# EAGLE schematic INA169_Breakout (EAGLE 6.5.0)

## Sheet 1 of 14: PV
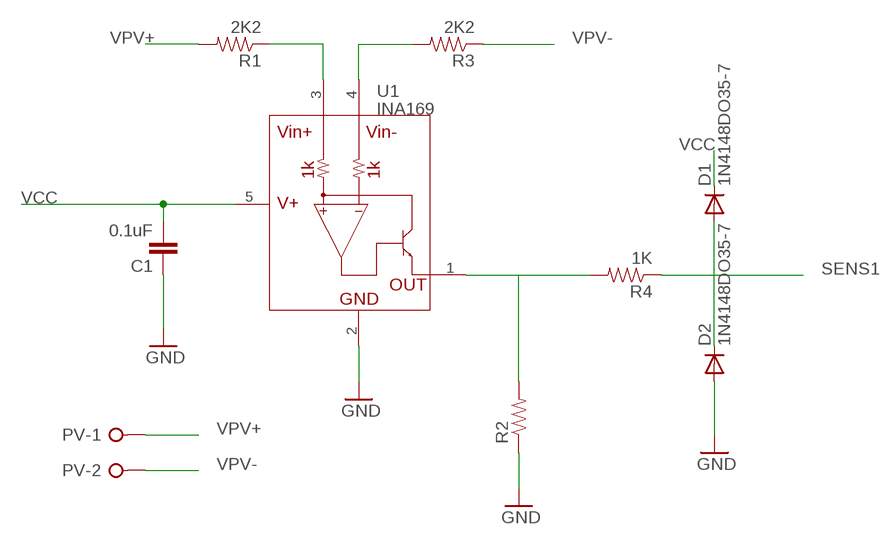
[diagram p0: schematic, sheet 1]

### Parts
C1  0.1uF  CAP0603-CAP  [0603-CAP]
D1  1N4148DO35-7  [DO35-7]
D2  1N4148DO35-7  [DO35-7]
PV  W237-02P  [W237-132]
R1  2K2  RESISTOR0603  [0603-RES]
R2  RESISTOR0603  [0603-RES]
R3  2K2  RESISTOR0603  [0603-RES]
R4  1K  RESISTOR0603  [0603-RES]
U1  INA169  [SOT23-5]

### Nets
GND: C1.1 D2.A R2.1 U1.2(GND) ; also sheet 2,3,4,5,6,7,8,9,10,11,12,13,14
N$1: R3.2 U1.4(VIN-)
N$2: R1.1 U1.3(VIN+)
N$3: R2.2 R4.2 U1.1(OUT)
SENS1: D1.A D2.C R4.1 ; also sheet 14
VCC: C1.2 D1.C U1.5(V+) ; also sheet 2,3,4,5,6,7,8,9,10,11,12,13,14
VPV+: PV.1 R1.2
VPV-: PV.2 R3.1

## Sheet 2 of 14: CHARGER
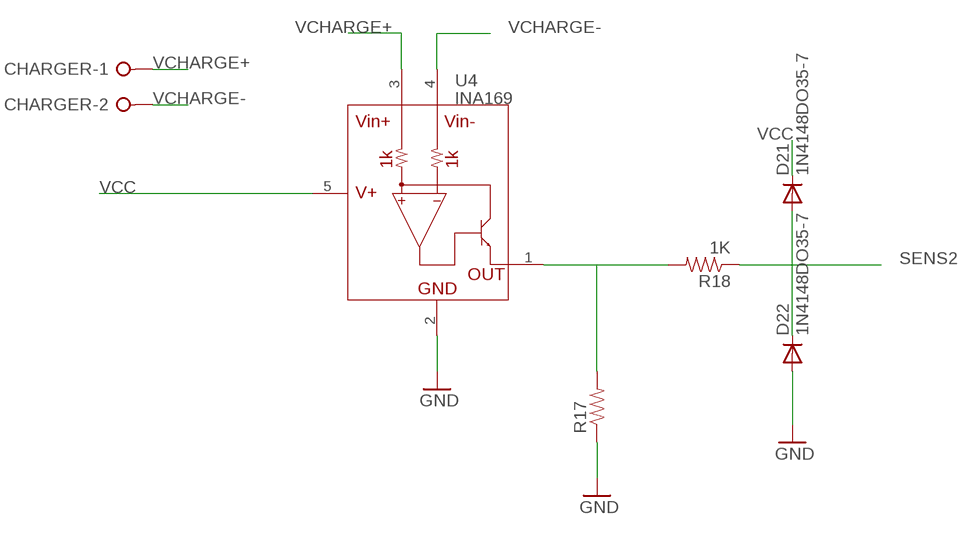
[diagram p1: schematic, sheet 2]

### Parts
CHARGER  W237-02P  [W237-132]
D21  1N4148DO35-7  [DO35-7]
D22  1N4148DO35-7  [DO35-7]
R17  RESISTOR0603  [0603-RES]
R18  1K  RESISTOR0603  [0603-RES]
U4  INA169  [SOT23-5]

### Nets
GND: D22.A R17.1 U4.2(GND) ; also sheet 1,3,4,5,6,7,8,9,10,11,12,13,14
N$4: R17.2 R18.2 U4.1(OUT)
SENS2: D21.A D22.C R18.1 ; also sheet 14
VCC: D21.C U4.5(V+) ; also sheet 1,3,4,5,6,7,8,9,10,11,12,13,14
VCHARGE+: CHARGER.1 U4.3(VIN+)
VCHARGE-: CHARGER.2 U4.4(VIN-)

## Sheet 3 of 14: BATT+
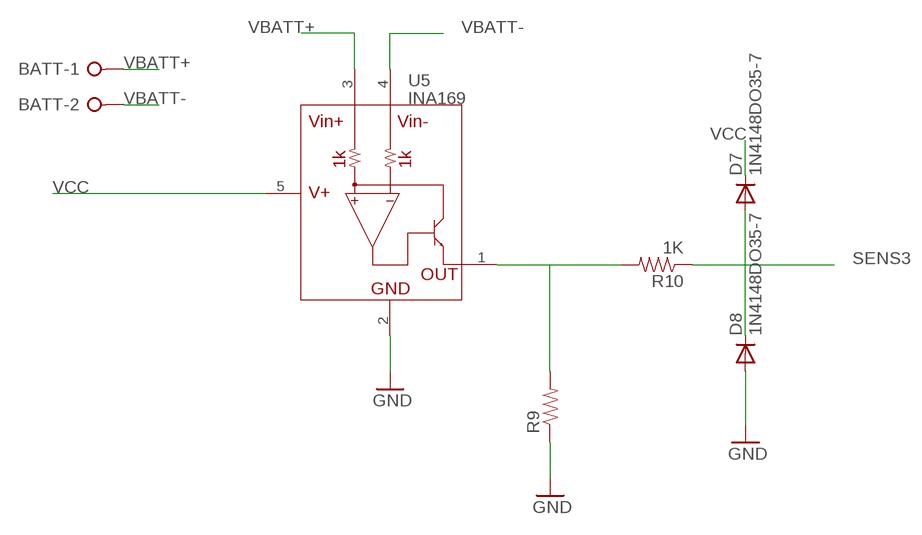
[diagram p2: schematic, sheet 3]

### Parts
BATT  W237-02P  [W237-132]
D7  1N4148DO35-7  [DO35-7]
D8  1N4148DO35-7  [DO35-7]
R9  RESISTOR0603  [0603-RES]
R10  1K  RESISTOR0603  [0603-RES]
U5  INA169  [SOT23-5]

### Nets
GND: D8.A R9.1 U5.2(GND) ; also sheet 1,2,4,5,6,7,8,9,10,11,12,13,14
N$5: R9.2 R10.2 U5.1(OUT)
SENS3: D7.A D8.C R10.1 ; also sheet 14
VBATT+: BATT.1 U5.3(VIN+) ; also sheet 4
VBATT-: BATT.2 U5.4(VIN-) ; also sheet 4
VCC: D7.C U5.5(V+) ; also sheet 1,2,4,5,6,7,8,9,10,11,12,13,14

## Sheet 4 of 14: BATT-
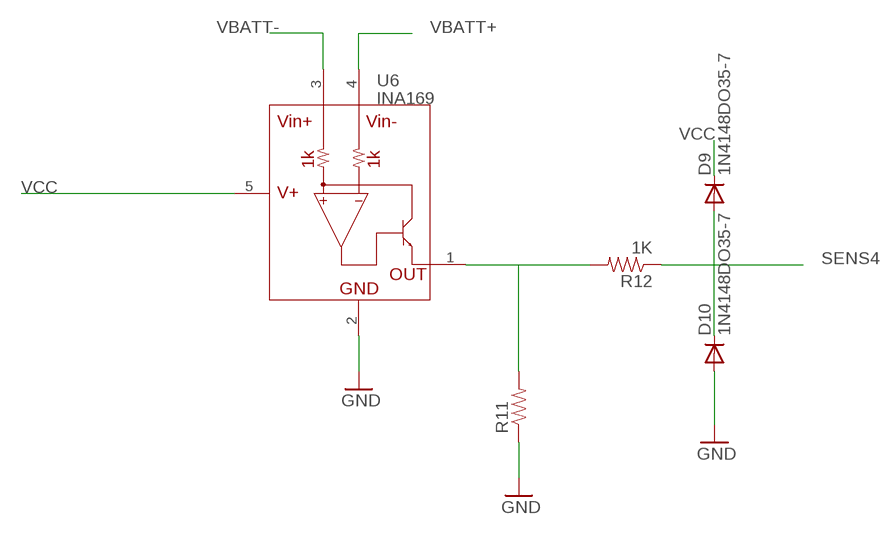
[diagram p3: schematic, sheet 4]

### Parts
D9  1N4148DO35-7  [DO35-7]
D10  1N4148DO35-7  [DO35-7]
R11  RESISTOR0603  [0603-RES]
R12  1K  RESISTOR0603  [0603-RES]
U6  INA169  [SOT23-5]

### Nets
GND: D10.A R11.1 U6.2(GND) ; also sheet 1,2,3,5,6,7,8,9,10,11,12,13,14
N$7: R11.2 R12.2 U6.1(OUT)
SENS4: D9.A D10.C R12.1 ; also sheet 14
VBATT+: U6.4(VIN-) ; also sheet 3
VBATT-: U6.3(VIN+) ; also sheet 3
VCC: D9.C U6.5(V+) ; also sheet 1,2,3,5,6,7,8,9,10,11,12,13,14

## Sheet 5 of 14: LOAD
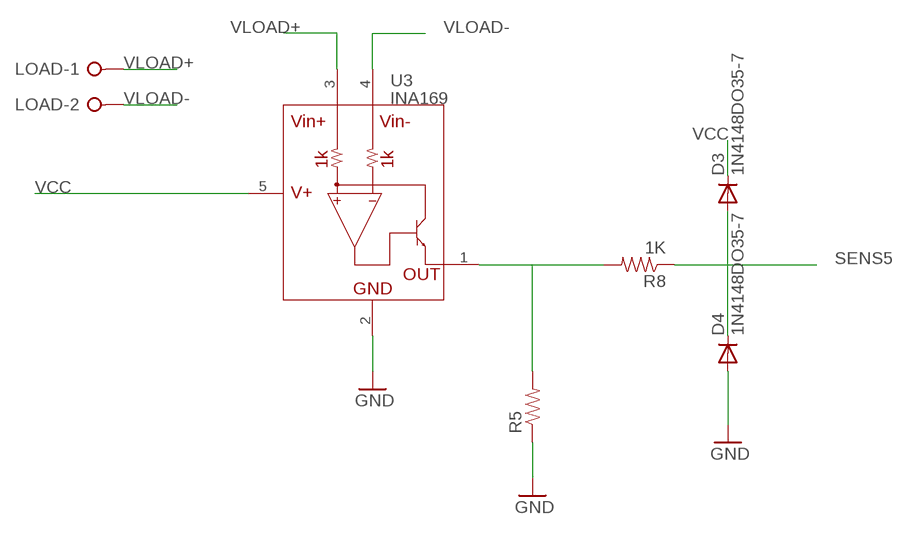
[diagram p4: schematic, sheet 5]

### Parts
D3  1N4148DO35-7  [DO35-7]
D4  1N4148DO35-7  [DO35-7]
LOAD  W237-02P  [W237-132]
R5  RESISTOR0603  [0603-RES]
R8  1K  RESISTOR0603  [0603-RES]
U3  INA169  [SOT23-5]

### Nets
GND: D4.A R5.1 U3.2(GND) ; also sheet 1,2,3,4,6,7,8,9,10,11,12,13,14
N$6: R5.2 R8.2 U3.1(OUT)
SENS5: D3.A D4.C R8.1 ; also sheet 14
VCC: D3.C U3.5(V+) ; also sheet 1,2,3,4,6,7,8,9,10,11,12,13,14
VLOAD+: LOAD.1 U3.3(VIN+)
VLOAD-: LOAD.2 U3.4(VIN-)

## Sheet 6 of 14: ADC1
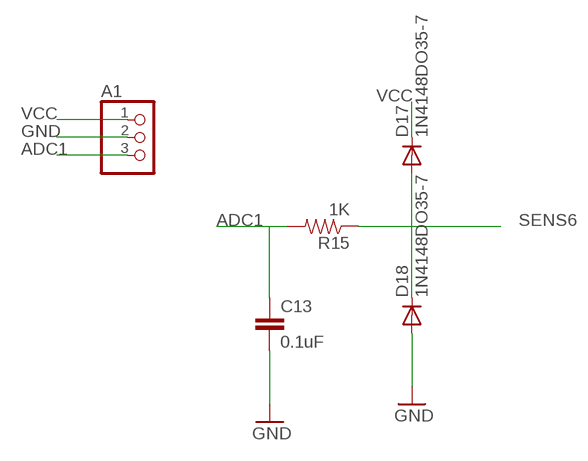
[diagram p5: schematic, sheet 6]

### Parts
A1  PINHD-1X3  [1X03]
C13  0.1uF  CAP0603-CAP  [0603-CAP]
D17  1N4148DO35-7  [DO35-7]
D18  1N4148DO35-7  [DO35-7]
R15  1K  RESISTOR0603  [0603-RES]

### Nets
ADC1: A1.3 C13.1 R15.2
GND: A1.2 C13.2 D18.A ; also sheet 1,2,3,4,5,7,8,9,10,11,12,13,14
SENS6: D17.A D18.C R15.1 ; also sheet 14
VCC: A1.1 D17.C ; also sheet 1,2,3,4,5,7,8,9,10,11,12,13,14

## Sheet 7 of 14: ADC2
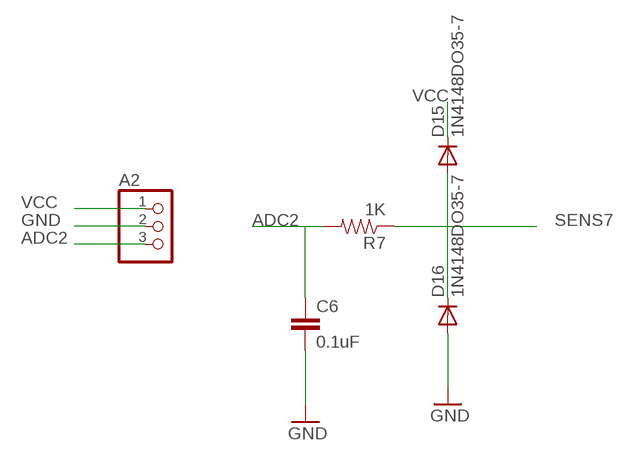
[diagram p6: schematic, sheet 7]

### Parts
A2  PINHD-1X3  [1X03]
C6  0.1uF  CAP0603-CAP  [0603-CAP]
D15  1N4148DO35-7  [DO35-7]
D16  1N4148DO35-7  [DO35-7]
R7  1K  RESISTOR0603  [0603-RES]

### Nets
ADC2: A2.3 C6.1 R7.2
GND: A2.2 C6.2 D16.A ; also sheet 1,2,3,4,5,6,8,9,10,11,12,13,14
SENS7: D15.A D16.C R7.1 ; also sheet 14
VCC: A2.1 D15.C ; also sheet 1,2,3,4,5,6,8,9,10,11,12,13,14

## Sheet 8 of 14: ADC3
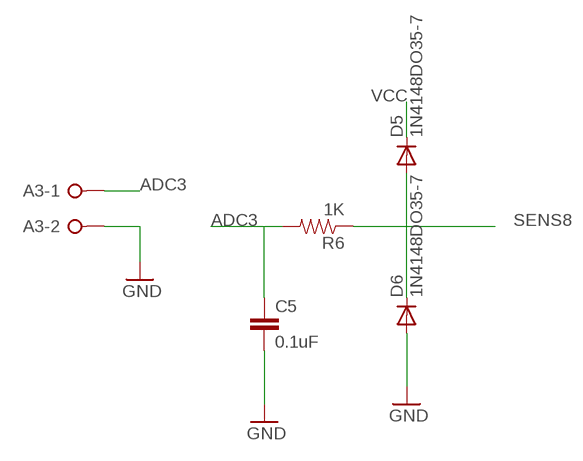
[diagram p7: schematic, sheet 8]

### Parts
A3  W237-02P  [W237-132]
C5  0.1uF  CAP0603-CAP  [0603-CAP]
D5  1N4148DO35-7  [DO35-7]
D6  1N4148DO35-7  [DO35-7]
R6  1K  RESISTOR0603  [0603-RES]

### Nets
ADC3: A3.1 C5.1 R6.2
GND: A3.2 C5.2 D6.A ; also sheet 1,2,3,4,5,6,7,9,10,11,12,13,14
SENS8: D5.A D6.C R6.1 ; also sheet 14
VCC: D5.C ; also sheet 1,2,3,4,5,6,7,9,10,11,12,13,14

## Sheet 9 of 14: ADC4
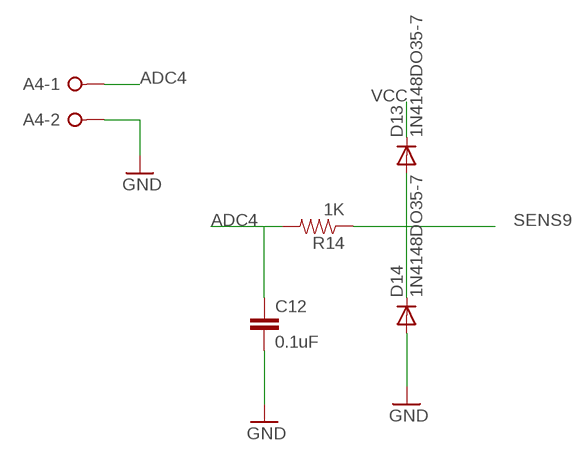
[diagram p8: schematic, sheet 9]

### Parts
A4  W237-02P  [W237-132]
C12  0.1uF  CAP0603-CAP  [0603-CAP]
D13  1N4148DO35-7  [DO35-7]
D14  1N4148DO35-7  [DO35-7]
R14  1K  RESISTOR0603  [0603-RES]

### Nets
ADC4: A4.1 C12.1 R14.2
GND: A4.2 C12.2 D14.A ; also sheet 1,2,3,4,5,6,7,8,10,11,12,13,14
SENS9: D13.A D14.C R14.1 ; also sheet 14
VCC: D13.C ; also sheet 1,2,3,4,5,6,7,8,10,11,12,13,14

## Sheet 10 of 14: ADC5
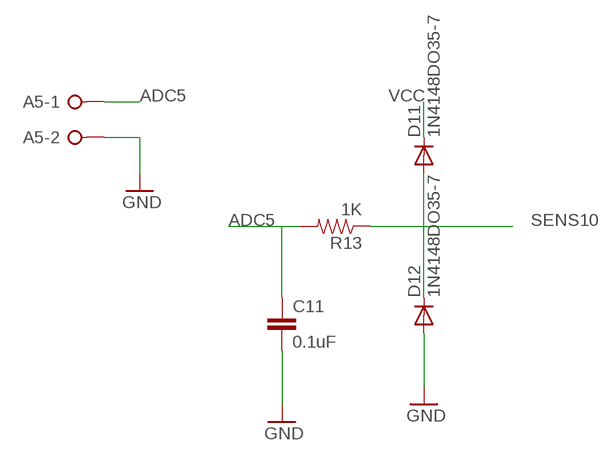
[diagram p9: schematic, sheet 10]

### Parts
A5  W237-02P  [W237-132]
C11  0.1uF  CAP0603-CAP  [0603-CAP]
D11  1N4148DO35-7  [DO35-7]
D12  1N4148DO35-7  [DO35-7]
R13  1K  RESISTOR0603  [0603-RES]

### Nets
ADC5: A5.1 C11.1 R13.2
GND: A5.2 C11.2 D12.A ; also sheet 1,2,3,4,5,6,7,8,9,11,12,13,14
SENS10: D11.A D12.C R13.1 ; also sheet 14
VCC: D11.C ; also sheet 1,2,3,4,5,6,7,8,9,11,12,13,14

## Sheet 11 of 14: RTC
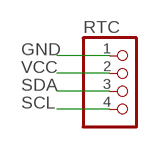
[diagram p10: schematic, sheet 11]

### Parts
RTC  PINHD-1X4/90  [1X04/90]

### Nets
GND: RTC.1 ; also sheet 1,2,3,4,5,6,7,8,9,10,12,13,14
SCL: RTC.4 ; also sheet 14
SDA: RTC.3 ; also sheet 14
VCC: RTC.2 ; also sheet 1,2,3,4,5,6,7,8,9,10,12,13,14

## Sheet 12 of 14: DHT
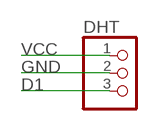
[diagram p11: schematic, sheet 12]

### Parts
DHT  PINHD-1X3  [1X03]

### Nets
D1: DHT.3 ; also sheet 14
GND: DHT.2 ; also sheet 1,2,3,4,5,6,7,8,9,10,11,13,14
VCC: DHT.1 ; also sheet 1,2,3,4,5,6,7,8,9,10,11,13,14

## Sheet 13 of 14: TSL
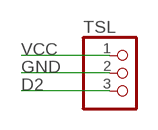
[diagram p12: schematic, sheet 13]

### Parts
TSL  PINHD-1X3  [1X03]

### Nets
D2: TSL.3 ; also sheet 14
GND: TSL.2 ; also sheet 1,2,3,4,5,6,7,8,9,10,11,12,14
VCC: TSL.1 ; also sheet 1,2,3,4,5,6,7,8,9,10,11,12,14

## Sheet 14 of 14: Shield
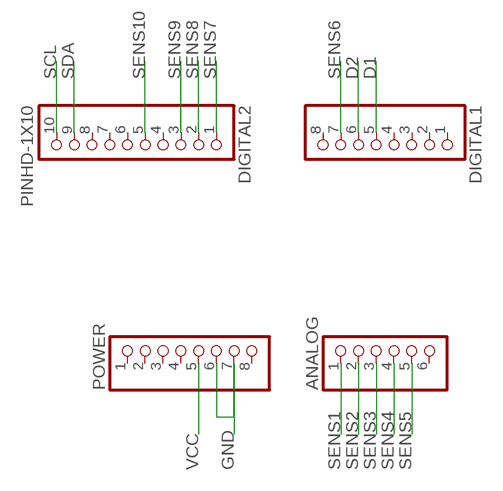
[diagram p13: schematic, sheet 14]

### Parts
ANALOG  PINHD-1X6B  [1X06-BIG]
DIGITAL1  PINHD-1X8BIG  [1X08-BIG]
DIGITAL2  PINHD-1X10  [1X10-BIG]
POWER  PINHD-1X8BIG  [1X08-BIG]

### Nets
D1: DIGITAL1.5 ; also sheet 12
D2: DIGITAL1.6 ; also sheet 13
GND: POWER.6 POWER.7 ; also sheet 1,2,3,4,5,6,7,8,9,10,11,12,13
SCL: DIGITAL2.10 ; also sheet 11
SDA: DIGITAL2.9 ; also sheet 11
SENS1: ANALOG.1 ; also sheet 1
SENS2: ANALOG.2 ; also sheet 2
SENS3: ANALOG.3 ; also sheet 3
SENS4: ANALOG.4 ; also sheet 4
SENS5: ANALOG.5 ; also sheet 5
SENS6: DIGITAL1.7 ; also sheet 6
SENS7: DIGITAL2.1 ; also sheet 7
SENS8: DIGITAL2.2 ; also sheet 8
SENS9: DIGITAL2.3 ; also sheet 9
SENS10: DIGITAL2.5 ; also sheet 10
VCC: POWER.5 ; also sheet 1,2,3,4,5,6,7,8,9,10,11,12,13
Unconnected: ANALOG.6 DIGITAL1.1 DIGITAL1.2 DIGITAL1.3 DIGITAL1.4 DIGITAL1.8 DIGITAL2.4 DIGITAL2.6 DIGITAL2.7 DIGITAL2.8 POWER.1 POWER.2 POWER.3 POWER.4 POWER.8

## Library data of the parts
A1 A2 DHT TSL = adafruit:PINHD-1X3: PIN HEADER
A3-A5 BATT CHARGER LOAD PV = con-wago-508:W237-02P: WAGO SREW CLAMP; OC_FARNELL: unknown; OC_NEWARK: unknown
ANALOG = adafruit:PINHD-1X6: PIN HEADER
C1 C5 C6 C11-C13 = SparkFun-Passives:CAP: Capacitor Standard 0603 ceramic capacitor, and 0.1" leaded capacitor.
D1-D18 D21 D22 = diode:1N4148: DIODE high speed (Philips)
DIGITAL1 POWER = adafruit:PINHD-1X8: PIN HEADER
DIGITAL2 = adafruit:PINHD-1X10: Pin header 1x10 0.1" spacing With round pins
R1-R15 R17 R18 = SparkFun-Resistors:RESISTOR: Resistor Basic schematic elements and footprints for 0603, 1206, and PTH resistors.; TOL: 1%
RTC = pinhead:PINHD-1X4: PIN HEADER
U1 U3-U6 = SparkFun-AnalogIC:INA169